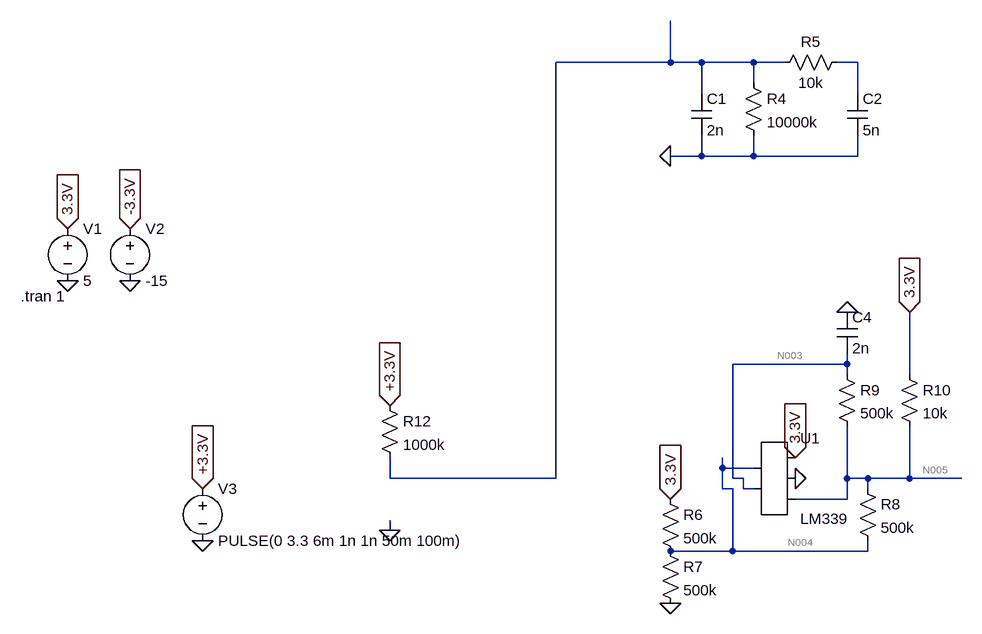
[diagram p0: schematic Relaxation Oscillator.asc]
Relaxation Oscillator.asc, the LTspice schematic file:
Version 4
SHEET 1 1768 1044
WIRE 528 80 528 16
WIRE 528 80 352 80
WIRE 576 80 528 80
WIRE 656 80 576 80
WIRE 704 80 656 80
WIRE 816 80 784 80
WIRE 656 112 656 80
WIRE 576 128 576 80
WIRE 816 128 816 80
WIRE 576 224 576 192
WIRE 576 224 528 224
WIRE 656 224 656 192
WIRE 656 224 576 224
WIRE 816 224 816 192
WIRE 816 224 656 224
WIRE 800 544 800 528
WIRE 800 544 624 544
WIRE 800 560 800 544
WIRE 896 560 896 464
WIRE 608 704 608 688
WIRE 656 704 608 704
WIRE 96 720 96 688
WIRE 352 720 352 80
WIRE 352 720 96 720
WIRE 624 720 624 544
WIRE 640 720 624 720
WIRE 800 720 800 640
WIRE 832 720 800 720
WIRE 896 720 896 640
WIRE 896 720 832 720
WIRE 976 720 896 720
WIRE 608 736 608 704
WIRE 624 736 608 736
WIRE 640 736 640 720
WIRE 656 736 640 736
WIRE 832 736 832 720
WIRE 800 752 800 720
WIRE 800 752 720 752
WIRE 96 800 96 784
WIRE 624 832 624 736
WIRE 624 832 528 832
WIRE 832 832 832 816
WIRE 832 832 624 832
FLAG -400 416 0
FLAG -304 416 0
FLAG -400 336 3.3V
IOPIN -400 336 In
FLAG -304 336 -3.3V
IOPIN -304 336 In
FLAG 528 224 0
FLAG 720 688 3.3V
IOPIN 720 688 In
FLAG 800 464 0
FLAG 528 912 0
FLAG 896 464 3.3V
IOPIN 896 464 In
FLAG 528 752 3.3V
IOPIN 528 752 In
FLAG 720 720 0
FLAG -192 816 0
FLAG -192 736 +3.3V
IOPIN -192 736 In
FLAG 96 800 0
FLAG 96 608 +3.3V
IOPIN 96 608 In
SYMBOL voltage -400 320 R0
WINDOW 123 0 0 Left 0
WINDOW 39 0 0 Left 0
SYMATTR InstName V1
SYMATTR Value 5
SYMBOL voltage -304 320 R0
WINDOW 123 0 0 Left 0
WINDOW 39 0 0 Left 0
SYMATTR InstName V2
SYMATTR Value -15
SYMBOL cap 560 128 R0
SYMATTR InstName C1
SYMATTR Value 2n
SYMBOL cap 800 128 R0
SYMATTR InstName C2
SYMATTR Value 5n
SYMBOL res 640 96 R0
SYMATTR InstName R4
SYMATTR Value 10000k
SYMBOL res 800 64 R90
WINDOW 0 0 56 VBottom 2
WINDOW 3 32 56 VTop 2
SYMATTR InstName R5
SYMATTR Value 10k
SYMBOL res 512 736 R0
SYMATTR InstName R6
SYMATTR Value 500k
SYMBOL res 512 816 R0
SYMATTR InstName R7
SYMATTR Value 500k
SYMBOL res 816 720 R0
SYMATTR InstName R8
SYMATTR Value 500k
SYMBOL res 784 544 R0
SYMATTR InstName R9
SYMATTR Value 500k
SYMBOL res 880 544 R0
SYMATTR InstName R10
SYMATTR Value 10k
SYMBOL cap 784 464 R0
SYMATTR InstName C4
SYMATTR Value 2n
SYMBOL AutoGenerated\\LM339 688 720 R0
SYMATTR InstName U1
SYMBOL voltage -192 720 R0
WINDOW 123 0 0 Left 0
WINDOW 39 0 0 Left 0
SYMATTR InstName V3
SYMATTR Value PULSE(0 3.3 6m 1n 1n 50m 100m)
SYMBOL res 80 592 R0
SYMATTR InstName R12
SYMATTR Value 1000k
TEXT -472 440 Left 2 !.tran 1

The netlist it stands for:
* Relaxation Oscillator.asc
V1 3.3V 0 5
V2 -3.3V 0 -15
C1 N001 0 2n
C2 N002 0 5n
R4 N001 0 10000k
R5 N002 N001 10k
R6 3.3V N004 500k
R7 N004 0 500k
R8 N005 N004 500k
R9 N003 N005 500k
R10 3.3V N005 10k
C4 0 N003 2n
* U1: LM339 (symbol AutoGenerated\LM339 not available, pins judged from their places): pin1=N004 pin2=N003 pin3=3.3V pin4=0 pin5=N005
V3 +3.3V 0 PULSE(0 3.3 6m 1n 1n 50m 100m)
R12 +3.3V N001 1000k
.tran 1
.backanno
.end

* Results of the author's LTspice run, read from the files saved beside the schematic
* Operating Point, zero values left out:
*   V(3.3v) = 5 V
*   V(-3.3v) = -15 V
*   V(n004) = 2.5 V
*   V(n005) = 2.487 V
*   V(n003) = 2.5 V
*   I(R10) = 251.3 µA
*   I(R9) = 25.01 nA
*   I(R8) = -25.1 nA
*   I(R7) = 5 µA
*   I(R6) = 5 µA
*   I(V1) = -464.2 µA
*   Ix(u1:1) = -24.96 nA
*   Ix(u1:2) = -25.01 nA
*   Ix(u1:3) = 208 µA
*   Ix(u1:4) = -459.2 µA
*   Ix(u1:5) = 251.3 µA